# Altium schematic sheet MotionSense.SchDoc
size 381 x 241 mm
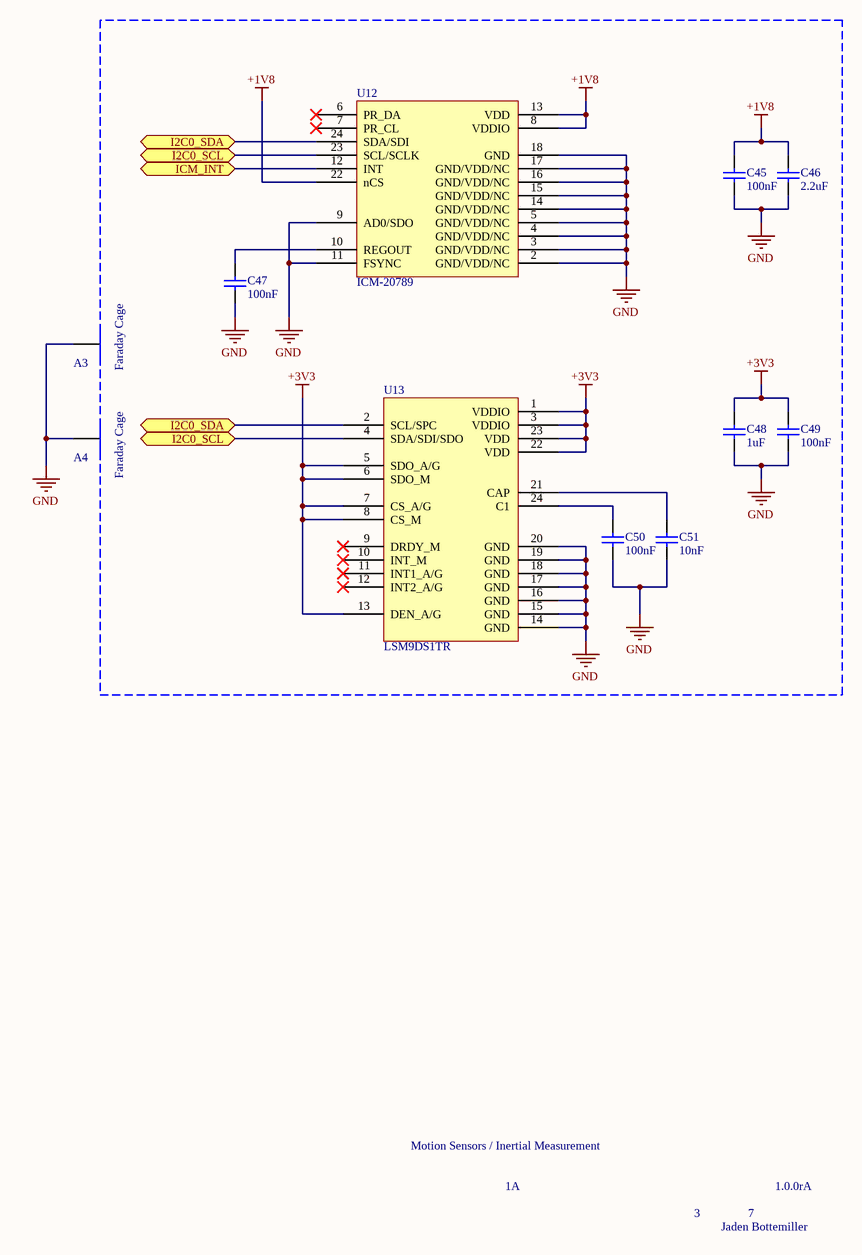
[diagram p0: MotionSense.SchDoc]

## Parts
A3  Faraday Cage
A4  Faraday Cage
C45  value 100nF  (hidden comment: CAP)
C46  value 2.2uF  (hidden comment: CAP)
C47  value 100nF  (hidden comment: CAP)
C48  value 1uF  (hidden comment: CAP)
C49  value 100nF  (hidden comment: CAP)
C50  value 100nF  (hidden comment: CAP)
C51  value 10nF  (hidden comment: CAP)
U12  ICM-20789
U13  LSM9DS1TR

## Ports
I2C0_SCL (bidir), I2C0_SDA (bidir), ICM_INT (bidir)

## Nets
+1V8: C45.2 C46.2 U12.8(VDDIO) U12.13(VDD) U12.22(nCS)
+3V3: C48.2 C49.2 U13.1(VDDIO) U13.3(VDDIO) U13.5(SDO_A/G) U13.6(SDO_M) U13.7(CS_A/G) U13.8(CS_M) U13.13(DEN_A/G) U13.22(VDD) U13.23(VDD)
GND: A3.1(Pin) A4.1(Pin) C45.1 C46.1 C47.1 C48.1 C49.1 C50.1 C51.1 U12.2(GND/VDD/NC) U12.3(GND/VDD/NC) U12.4(GND/VDD/NC) U12.5(GND/VDD/NC) U12.9(AD0/SDO) U12.11(FSYNC) U12.14(GND/VDD/NC) U12.15(GND/VDD/NC) U12.16(GND/VDD/NC) U12.17(GND/VDD/NC) U12.18(GND) U13.14(GND) U13.15(GND) U13.16(GND) U13.17(GND) U13.18(GND) U13.19(GND) U13.20(GND)
I2C0_SCL: U12.23(SCL/SCLK) U13.4(SDA/SDI/SDO) ; port I2C0_SCL
I2C0_SDA: U12.24(SDA/SDI) U13.2(SCL/SPC) ; port I2C0_SDA
ICM_INT: U12.12(INT) ; port ICM_INT
NetC47_2: C47.2 U12.10(REGOUT)
NetC50_2: C50.2 U13.24(C1)
NetC51_2: C51.2 U13.21(CAP)

Not connected (* = marked no-connect by the designer): U12 1(NC) 6(PR_DA)* 7(PR_CL)* 19(NC) 20(NC) 21(NC); U13 9(DRDY_M)* 10(INT_M)* 11(INT1_A/G)* 12(INT2_A/G)*

## Notes on the sheet
- Motion Sensors / Inertial Measurement
- 1A
- 3
- 7
- 1.0.0rA
- Jaden Bottemiller

## Library data of the parts
A3 A4 = Faraday Cage: Standard Faraday Cage
C45-C51 = CAP: Standard Capacitor
U12 = ICM-20789: Accelerometer, Gyroscope, Barometric Pressure Sensor. 3-Axis I2C; ComponentLink1Description: DigiKey; ComponentLink1URL: https://www.digikey.com/product-detail/en/tdk-invensense/ICM-20789/1428-1133-1-ND/7794714; ComponentLink2Description: Datasheet; ComponentLink2URL: http://www.invensense.com/wp-content/uploads/2017/10/DS-000169-ICM-20789-TYP-v1.3.pdf
U13 = LSM9DS1TR: Accelerometer, Gyroscope, Magnetometer, Temperature, 3 Axis Sensor I²C, SPI Output; ComponentLink1Description: DigiKey; ComponentLink1URL: https://www.digikey.com/product-detail/en/stmicroelectronics/LSM9DS1TR/497-14946-1-ND/4988079; ComponentLink2Description: Datasheet; ComponentLink2URL: https://www.st.com/content/ccc/resource/technical/document/datasheet/1e/3f/2a/d6/25/eb/48/46/DM00103319.pdf/files/DM00103319.pdf/jcr:content/translations/en.DM00103319.pdf